# Altium schematic sheet STM32F100RxT_simple.SchDoc
size A4
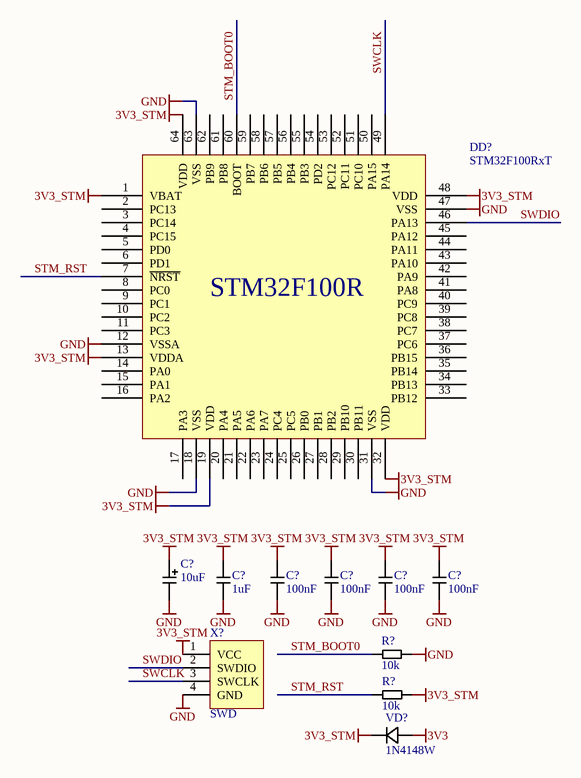
[diagram p0: STM32F100RxT_simple.SchDoc]

## Parts
(Parts that share a designator on the sheet are numbered #1, #2 ... from top to bottom, then left to right.)
C?#1  10uF  [SMD A]
C?#2  1uF  [C0603]
C?#3  100nF  [C0603]
C?#4  100nF  [C0603]
C?#5  100nF  [C0603]
C?#6  100nF  [C0603]
DD?  STM32F100RxT  [LQFP-64]
R?#1  10k  [R0603]
R?#2  10k  [R0603]
VD?  1N4148W  [SOD-123]
X?  SWD  [SWD-4]

## Nets
3V3: VD?.1(K)
3V3_STM: C?#1.1 C?#2.1 C?#3.1 C?#4.1 C?#5.1 C?#6.1 DD?.1(VBAT) DD?.13(VDDA) DD?.19(VDD) DD?.32(VDD) DD?.48(VDD) DD?.64(VDD) R?#2.2 VD?.2(A) X?.1(VCC)
GND: C?#1.2 C?#2.2 C?#3.2 C?#4.2 C?#5.2 C?#6.2 DD?.12(VSSA) DD?.18(VSS) DD?.31(VSS) DD?.47(VSS) DD?.63(VSS) R?#1.1 X?.4(GND)
STM_BOOT0: DD?.60(BOOT) R?#1.2
STM_RST: DD?.7(~{NRST}) R?#2.1
SWCLK: DD?.49(PA14) X?.3(SWCLK)
SWDIO: DD?.46(PA13) X?.2(SWDIO)

Not connected (* = marked no-connect by the designer): DD? 2(PC13) 3(PC14) 4(PC15) 5(PD0) 6(PD1) 8(PC0) 9(PC1) 10(PC2) 11(PC3) 14(PA0) 15(PA1) 16(PA2) 17(PA3) 20(PA4) 21(PA5) 22(PA6) 23(PA7) 24(PC4) 25(PC5) 26(PB0) 27(PB1) 28(PB2) 29(PB10) 30(PB11) 33(PB12) 34(PB13) 35(PB14) 36(PB15) 37(PC6) 38(PC7) 39(PC8) 40(PC9) 41(PA8) 42(PA9) 43(PA10) 44(PA11) 45(PA12) 50(PA15) 51(PC10) 52(PC11) 53(PC12) 54(PD2) 55(PB3) 56(PB4) 57(PB5) 58(PB6) 59(PB7) 61(PB8) 62(PB9)

## Notes on the sheet
- (in symbol STM32F100RxT) STM32F100R

## Library data of the parts
C?#1 = CP: Capacitor polarized
C?#2-C?#6 = C: Capacitor
DD? = STM32F100RxT: STM Microcontroller
R?#1 R?#2 = R: Resistor
VD? = Diode: SMD diode
X? = SWD_4: SWD connector